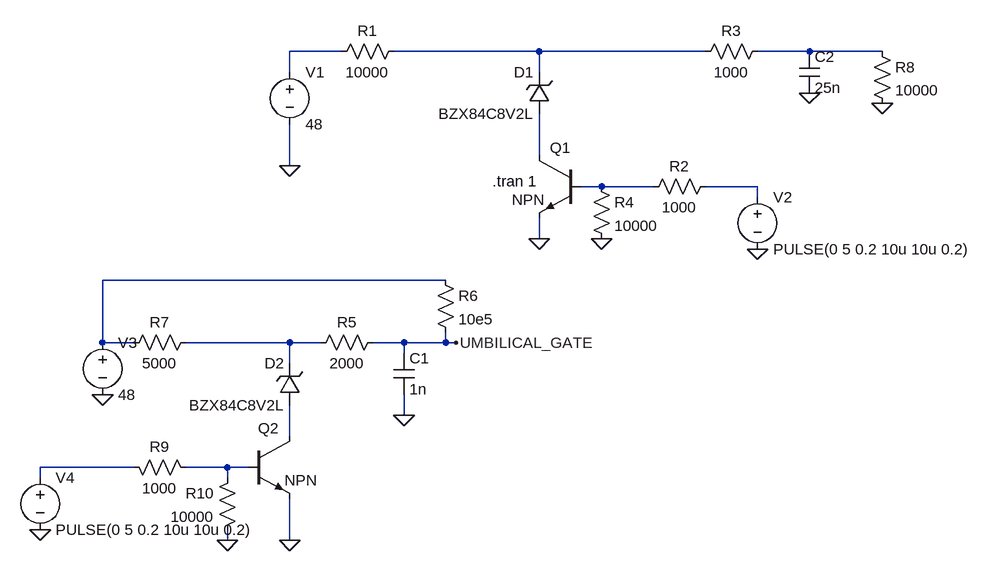
[diagram p0: schematic Zener npn level shift umbilical gate drive circuit.asc]
Zener npn level shift umbilical gate drive circuit.asc, the LTspice schematic file:
Version 4.1
SHEET 1 932 964
WIRE -64 48 -144 48
WIRE 240 48 16 48
WIRE 496 48 240 48
WIRE 656 48 576 48
WIRE 768 48 656 48
WIRE -144 80 -144 48
WIRE 240 80 240 48
WIRE 240 208 240 144
WIRE -144 224 -144 160
WIRE 336 256 304 256
WIRE 416 256 336 256
WIRE 576 256 496 256
WIRE 576 272 576 256
WIRE 240 336 240 304
WIRE 96 400 -432 400
WIRE -432 496 -432 400
WIRE -384 496 -432 496
WIRE -144 496 -304 496
WIRE -96 496 -144 496
WIRE 32 496 -16 496
WIRE 96 496 96 480
WIRE 96 496 32 496
WIRE 112 496 96 496
WIRE 32 512 32 496
WIRE -144 528 -144 496
WIRE 32 608 32 576
WIRE -144 640 -144 592
WIRE -384 688 -528 688
WIRE -240 688 -304 688
WIRE -208 688 -240 688
WIRE -528 704 -528 688
WIRE -240 704 -240 688
WIRE -240 800 -240 784
WIRE -144 800 -144 736
FLAG -144 224 0
FLAG 240 336 0
FLAG 576 352 0
FLAG 656 112 0
FLAG 768 128 0
FLAG 336 336 0
FLAG 32 608 0
FLAG -240 800 0
FLAG -144 800 0
FLAG 112 496 UMBILICAL_GATE
FLAG -432 576 0
FLAG -528 784 0
SYMBOL zener 256 144 R180
WINDOW 0 24 64 Left 2
WINDOW 3 24 0 Left 2
SYMATTR InstName D1
SYMATTR Value BZX84C8V2L
SYMBOL voltage -144 64 R0
WINDOW 123 0 0 Left 0
WINDOW 39 0 0 Left 0
SYMATTR InstName V1
SYMATTR Value 48
SYMBOL res 32 32 R90
WINDOW 0 0 56 VBottom 2
WINDOW 3 32 56 VTop 2
SYMATTR InstName R1
SYMATTR Value 10000
SYMBOL npn 304 208 M0
WINDOW 0 15 -12 Left 2
SYMATTR InstName Q1
SYMBOL voltage 576 256 R0
WINDOW 123 0 0 Left 0
WINDOW 39 0 0 Left 0
SYMATTR InstName V2
SYMATTR Value PULSE(0 5 0.2 10u 10u 0.2)
SYMBOL res 512 240 R90
WINDOW 0 0 56 VBottom 2
WINDOW 3 32 56 VTop 2
SYMATTR InstName R2
SYMATTR Value 1000
SYMBOL cap 640 48 R0
SYMATTR InstName C2
SYMATTR Value 25n
SYMBOL res 752 32 R0
SYMATTR InstName R8
SYMATTR Value 10000
SYMBOL res 592 32 R90
WINDOW 0 0 56 VBottom 2
WINDOW 3 32 56 VTop 2
SYMATTR InstName R3
SYMATTR Value 1000
SYMBOL res 320 240 R0
SYMATTR InstName R4
SYMATTR Value 10000
SYMBOL res -112 512 R270
WINDOW 0 32 56 VTop 2
WINDOW 3 0 56 VBottom 2
SYMATTR InstName R5
SYMATTR Value 2000
SYMBOL cap 16 512 R0
SYMATTR InstName C1
SYMATTR Value 1n
SYMBOL zener -128 592 R180
WINDOW 0 24 64 Left 2
WINDOW 3 24 0 Left 2
SYMATTR InstName D2
SYMATTR Value BZX84C8V2L
SYMBOL npn -208 640 R0
WINDOW 0 15 -12 Left 2
SYMATTR InstName Q2
SYMBOL res -400 672 M90
WINDOW 0 0 56 VBottom 2
WINDOW 3 32 56 VTop 2
SYMATTR InstName R9
SYMATTR Value 1000
SYMBOL res -224 688 M0
SYMATTR InstName R10
SYMATTR Value 10000
SYMBOL voltage -432 480 R0
WINDOW 123 0 0 Left 0
WINDOW 39 0 0 Left 0
SYMATTR InstName V3
SYMATTR Value 48
SYMBOL voltage -528 688 R0
WINDOW 123 0 0 Left 0
WINDOW 39 0 0 Left 0
SYMATTR InstName V4
SYMATTR Value PULSE(0 5 0.2 10u 10u 0.2)
SYMBOL res -288 480 R90
WINDOW 0 0 56 VBottom 2
WINDOW 3 32 56 VTop 2
SYMATTR InstName R7
SYMATTR Value 5000
SYMBOL res 80 384 R0
SYMATTR InstName R6
SYMATTR Value 10e5
TEXT 168 248 Left 2 !.tran 1

The netlist it stands for:
* Zener npn level shift umbilical gate drive circuit.asc
D1 N004 N002 BZX84C8V2L
V1 N001 0 48
R1 N002 N001 10000
Q1 N004 N005 0 0 NPN
V2 N006 0 PULSE(0 5 0.2 10u 10u 0.2)
R2 N006 N005 1000
C2 N003 0 25n
R8 N003 0 10000
R3 N003 N002 1000
R4 N005 0 10000
R5 N008 UMBILICAL_GATE 2000
C1 UMBILICAL_GATE 0 1n
D2 N009 N008 BZX84C8V2L
Q2 N009 N011 0 0 NPN
R9 N010 N011 1000
R10 N011 0 10000
V3 N007 0 48
V4 N010 0 PULSE(0 5 0.2 10u 10u 0.2)
R7 N008 N007 5000
R6 N007 UMBILICAL_GATE 10e5
.model D D
.lib standard.dio
.model NPN NPN
.model PNP PNP
.lib standard.bjt
.tran 1
.backanno
.end